# EAGLE design ib_wemos_shield (EAGLE 7.3.0)
PROJECT_AUTHOR: tinkerman.cat <xose.perez@gmail.com>; PROJECT_LICENSE: GPLv3; PROJECT_NAME: 4DSystems gen4-IB Wemos Mini Shield; PROJECT_VERSION: 0.1.20161021
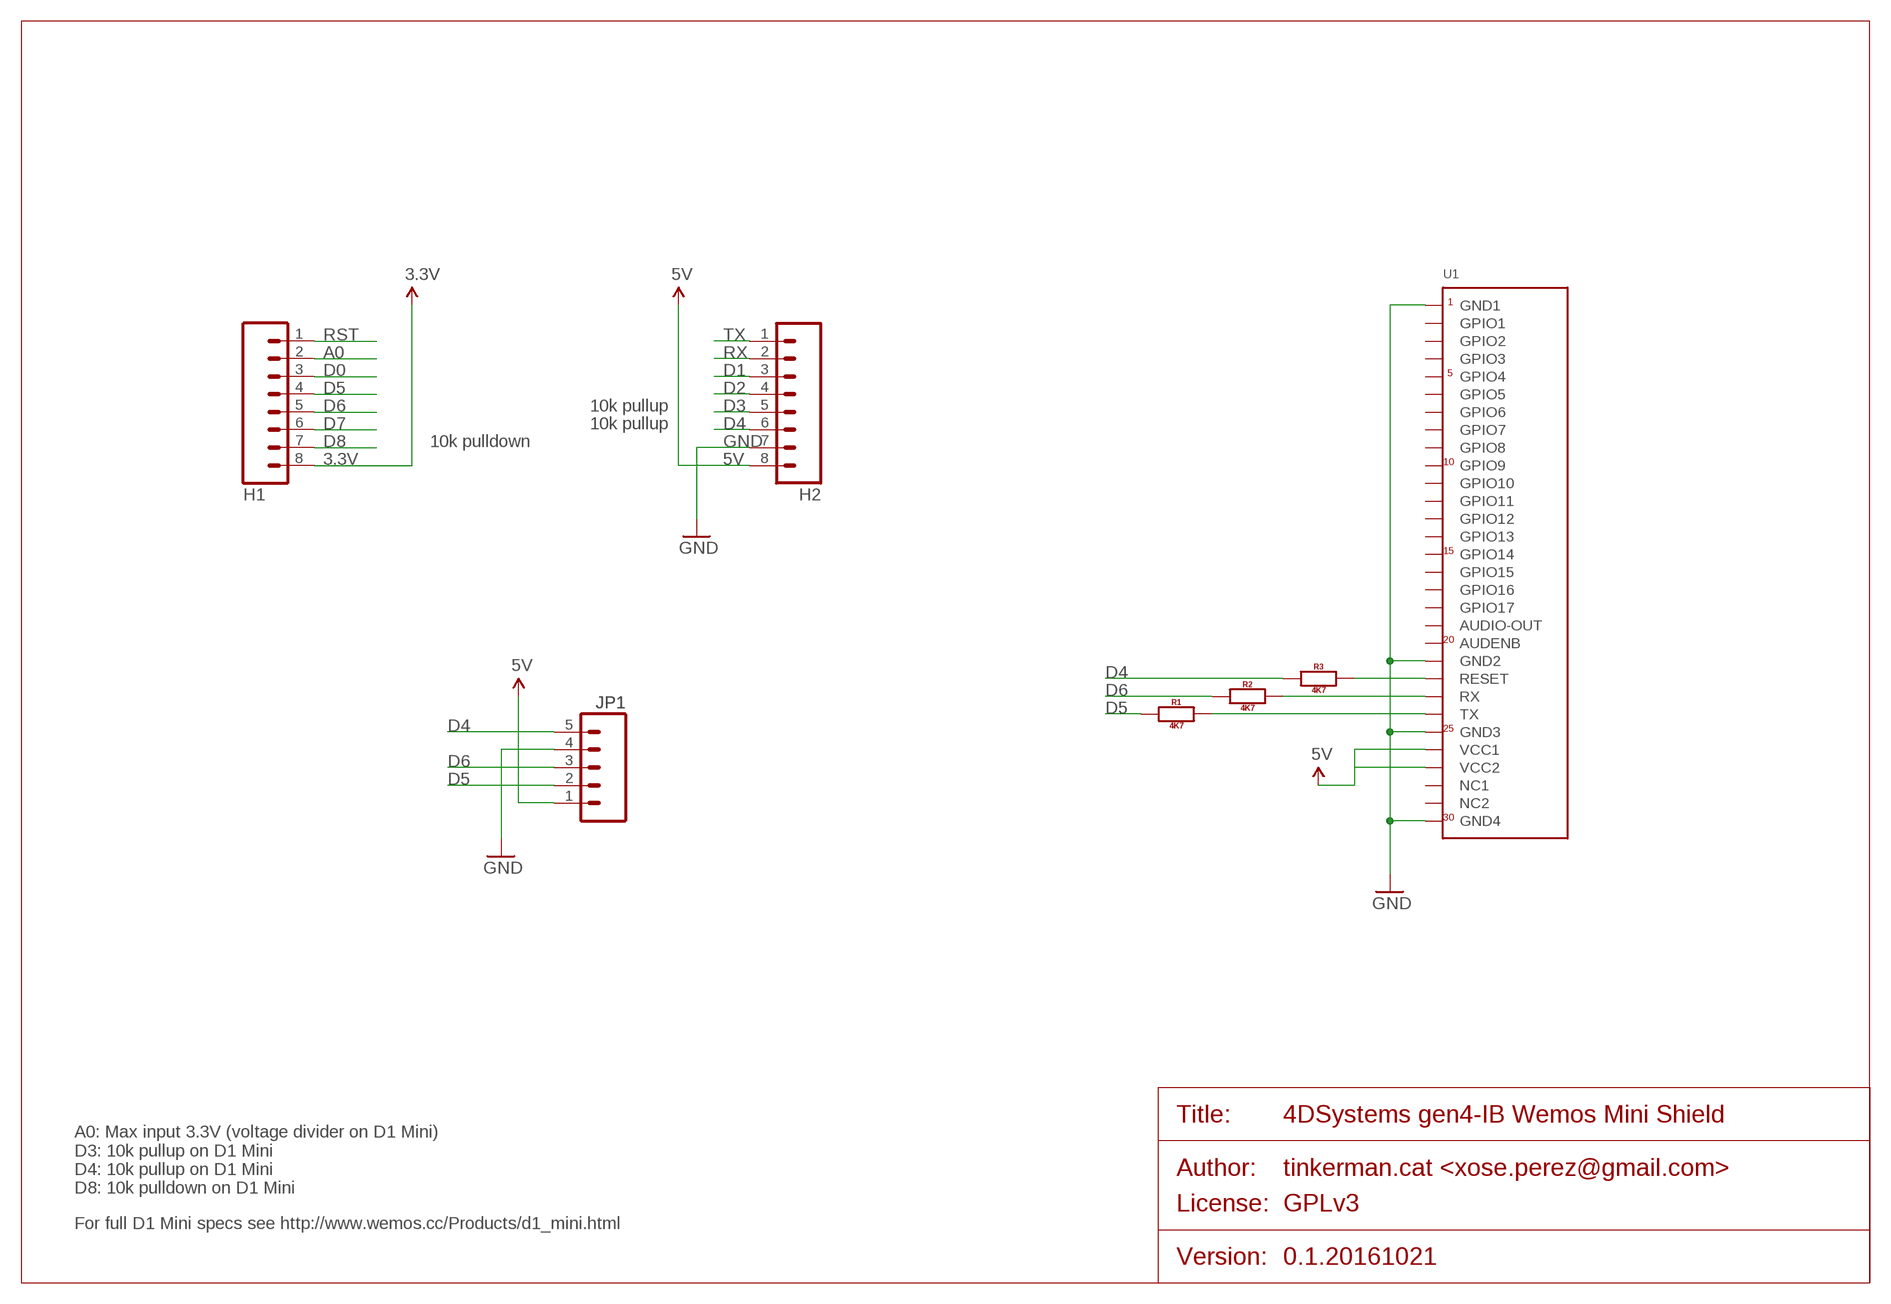
[diagram p0: schematic, sheet 1]

## Parts
H1  M08  [1X08_NO_SILK]
H2  M08  [1X08_NO_SILK]
JP1  M05PTH  [1X05]
R1  4K7  RESISTOR0805  [0805]
R2  4K7  RESISTOR0805  [0805]
R3  4K7  RESISTOR0805  [0805]
U1  4DSYSTEMS-GEN4-INTERFACETOP  [FPC_XF2M-3015-1A]

## Nets
3.3V: H1.8
5V: H2.8 JP1.1 U1.26(VCC1) U1.27(VCC2)
A0: H1.2
D0: H1.3
D1: H2.3
D2: H2.4
D3: H2.5
D4: H2.6 JP1.5 R3.1
D5: H1.4 JP1.2 R1.1
D6: H1.5 JP1.3 R2.1
D7: H1.6
D8: H1.7
GND: H2.7 JP1.4 U1.1(GND1) U1.21(GND2) U1.25(GND3) U1.30(GND4)
N$2: R1.2 U1.24(TX)
N$3: R2.2 U1.23(RX)
N$4: R3.2 U1.22(RESET)
RST: H1.1
RX: H2.2
TX: H2.1
Unconnected: U1.5(GPIO4) U1.6(GPIO5) U1.7(GPIO6) U1.8(GPIO7) U1.9(GPIO8) U1.10(GPIO9) U1.11(GPIO10) U1.12(GPIO11) U1.13(GPIO12) U1.14(GPIO13) U1.15(GPIO14) U1.16(GPIO15) U1.17(GPIO16) U1.18(GPIO17) U1.19(AUDIO-OUT) U1.20(AUDENB) U1.29(NC2)

## Notes on the sheet
- 10k pullup
- 10k pullup
- 10k pulldown
- A0: Max input 3.3V (voltage divider on D1 Mini)
  D3: 10k pullup on D1 Mini
  D4: 10k pullup on D1 Mini
  D8: 10k pulldown on D1 Mini
- For full D1 Mini specs see http://www.wemos.cc/Products/d1_mini.html

## Power pins joined to a net without a drawn wire
GPIO1: U1.2(GPIO1)
GPIO2: U1.3(GPIO2)
GPIO3: U1.4(GPIO3)
NC1: U1.28(NC1)

## Library data of the parts
H1 H2 = xose:M08
JP1 = xose:M05: Header 5 Standard 5-pin 0.1" header. Use with straight break away headers (SKU : PRT-00116), right angle break away headers (PRT-00553), swiss pins (PRT-00743), machine pins (PRT-00117), and female headers (PRT-00115). Molex polarized connector foot print use with SKU : PRT-08230 with associated crimp pins and housings.
R1-R3 = xose:RESISTOR: Generic EU resistor symbol
U1 = xose:4DSYSTEMS-GEN4-INTERFACE: 128x128 1.5" RGB OLED - UG-2828GDEDF11 30-Pin 0.5mm Pitch FPC Cable (Top+Bottom Contacts) - OMRON XF2M-3015-1A (Digikey: OR723TR-ND) This FPC connector has contacts on the top and bottom, but the appropriate pin needs to be selected depending on whether the OLED will be inserted right-side up (use the TOP pinout) or upside-down (use the BOTTOM pinout).

## Net classes
1 power: width 0.203 mm, clearance 0.152 mm

## Board
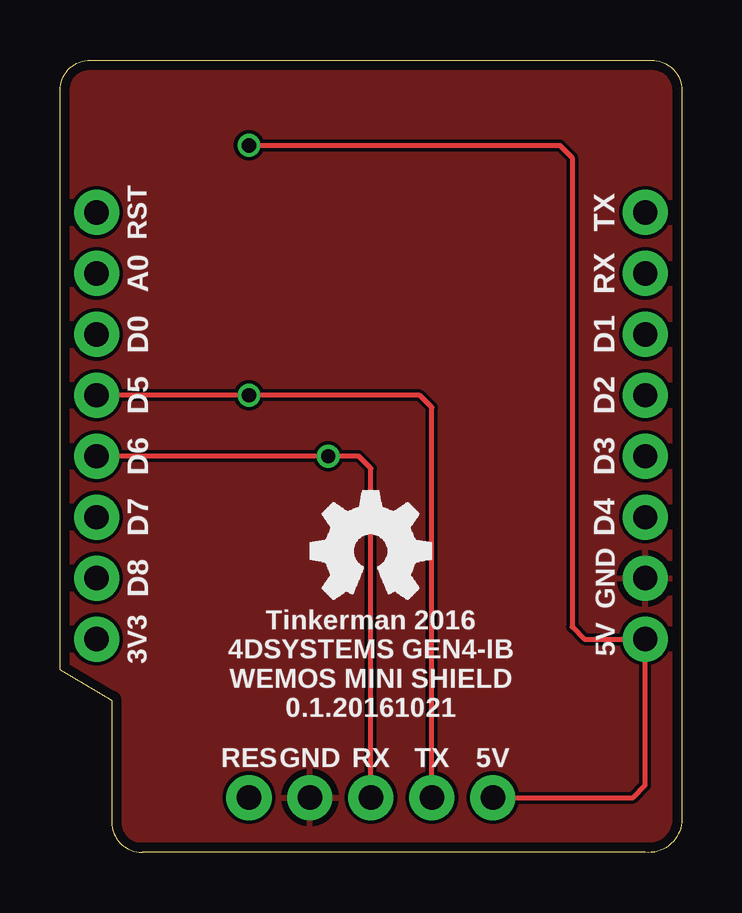
[diagram p1: board, top side]
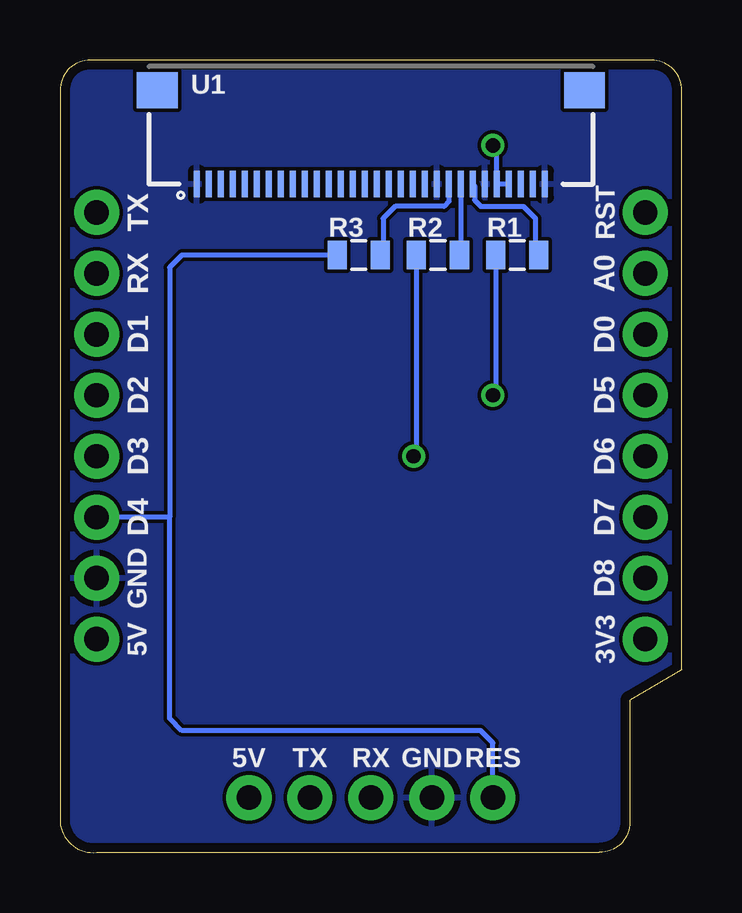
[diagram p2: board, bottom side, seen from below]

Size 25.91 x 33.03 mm. Coordinates in mm from the lower left corner, seen from the top.
Outline: 25.91,31.76 25.91,1.28 arc-90 24.38,0.01 3.43,0.01 arc-90 2.16,1.28 2.16,6.36 0,7.63 0,31.76 arc-90 1.27,33.03 24.64,33.03 arc-90 25.91,31.76
Copper layers (1*16): Top 0.0356mm / dielectric 1.5011mm / Bottom 0.0356mm
Design rules "oshpark-2layer": minimum track width 6mil, minimum drill 13mil, track to track 6mil, track to pad 6mil, pad to pad 6mil, via to via 6mil, smd to smd 6mil, copper to edge 15mil, drill to drill 6mil, minimum pad ring 7mil, minimum via ring 7mil, stop-mask expansion 2.5mil, vias tented up to drill 0mil, thermal gap 10mil

### Footprints (pad centres in the part's own frame; a part is rotated, then mirrored left to right if it is on the bottom)
1X08_NO_SILK = drill 1.016 pad 1.88: 1 0,0; 2 2.54,0; 3 5.08,0; 4 7.62,0; 5 10.16,0; 6 12.7,0; 7 15.24,0; 8 17.78,0
1X05 = drill 1.016 pad 1.88: 1 0,0; 2 2.54,0; 3 5.08,0; 4 7.62,0; 5 10.16,0
0805 = smd 0.8 x 1.2: 1 -0.9,0; 2 0.9,0
FPC_XF2M-3015-1A = smd 0.25 x 1.1: 1 -7.25,-2.63; 2 -6.75,-2.63; 3 -6.25,-2.63; 4 -5.75,-2.63; 5 -5.25,-2.63; 6 -4.75,-2.63; 7 -4.25,-2.63; 8 -3.75,-2.63; 9 -3.25,-2.63; 10 -2.75,-2.63; 11 -2.25,-2.63; 12 -1.75,-2.63; 13 -1.25,-2.63; 14 -0.75,-2.63; 15 -0.25,-2.63; 16 0.25,-2.63; 17 0.75,-2.63; 18 1.25,-2.63; 19 1.75,-2.63; 20 2.25,-2.63; 21 2.75,-2.63; 22 3.25,-2.63; 23 3.75,-2.63; 24 4.25,-2.63; 25 4.75,-2.63; 26 5.25,-2.63; 27 5.75,-2.63; 28 6.25,-2.63; 29 6.75,-2.63; 30 7.25,-2.63 | smd 1.7 x 1.5: SUPPORT1 -8.9,1.27; SUPPORT2 8.9,1.27

### Placement (x,y rotation side)
H1  1.52,26.68 270 top
H2  24.38,26.68 270 top
JP1  18.03,2.29 180 top
R1  6.86,24.9 0 bottom
R2  10.16,24.9 0 bottom
R3  13.46,24.9 0 bottom
U1  12.95,30.49 0 bottom

### Tracks (layer width: path | path; a pad name or v marks a point on that pad's centre or on a via)
5V  (via drill 0.6)
  Top 0.203: v7.87,29.47 20.83,29.47 21.34,28.96 21.34,9.4 21.84,8.9 H2.8 24.38,2.8 23.88,2.29 JP1.1
  Bottom 0.203: U1.27 U1.26 7.7,29.39 v7.87,29.47
D4
  Bottom 0.203: JP1.5 7.87,4.58 8.38,5.09 20.83,5.09 21.34,5.59 21.34,13.98 | 21.34,13.98 H2.6 | R3.1 20.83,24.9 21.34,24.39 21.34,13.98
D5  (via drill 0.6)
  Top 0.203: JP1.2 15.49,18.55 14.99,19.06 v7.87,19.06 H1.4
  Bottom 0.203: R1.1 7.76,19.17 v7.87,19.06
D6  (via drill 0.6)
  Top 0.203: JP1.3 12.95,16.01 12.45,16.52 v11.18,16.52 H1.5
  Bottom 0.203: R2.1 11.06,16.63 v11.18,16.52
GND
  pour Top: 25.91,31.76 arc90 24.38,33.03 1.52,33.03 arc90 0,31.76 0.25,7.63 2.16,6.36 2.16,1.28 arc90 3.43,0.01 24.38,0.01 arc90 25.65,1.28
  pour Bottom: 25.65,1.28 25.91,31.76 arc90 24.38,33.03 1.52,33.03 arc90 0,31.76 0.25,7.63 2.16,6.36 2.16,1.28 arc90 3.43,0.01 24.38,0.01 arc90
N$2
  Bottom 0.203: U1.24 8.64,27.79 8.64,27.18 8.38,26.93 6.6,26.93 6.1,26.42 6.1,25.04 R1.2
N$3
  Bottom 0.203: U1.23 9.2,25.21 R2.2
N$4
  Bottom 0.203: U1.22 9.7,27.13 9.91,26.93 11.94,26.93 12.45,26.42 12.45,25.01 R3.2

### Text on the board
tPlace: RST | TX | A0 | RX | D0 | D1 | D5 | D2 | D6 | D3 | D7 | D4 | D8 | GND | 3V3 | 5V | Tinkerman 2016 / 4DSYSTEMS GEN4-IB / WEMOS MINI SHIELD / 0.1.20161021 | RES | GND | RX | TX | 5V
bPlace: RST | TX | A0 | RX | D0 | D1 | D5 | D2 | D6 | D3 | D7 | D4 | D8 | GND | 3V3 | 5V | RES | GND | RX | TX | 5V